# Altium schematic sheet FLASH.SchDoc
size A4
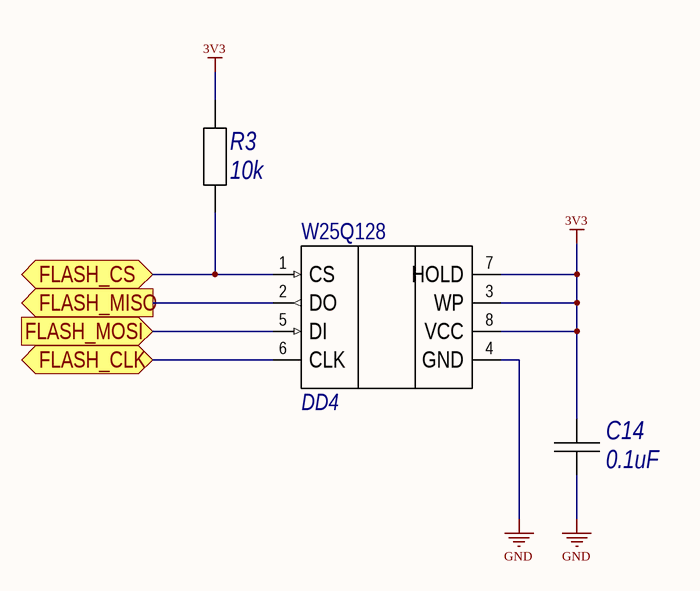
[diagram p0: FLASH.SchDoc]

## Parts
C14  0.1uF  [C0805C]
DD4  W25Q128  [SOIC8 (SO-8)]
R3  10k  [C0805R]

## Ports
FLASH_CLK (bidir), FLASH_CS (bidir), FLASH_MISO (out), FLASH_MOSI (in)

## Nets
3V3: C14.2 DD4.3(WP) DD4.7(HOLD) DD4.8(VCC) R3.2
GND: C14.1 DD4.4(GND)
FLASH_CLK: DD4.6(CLK) ; port FLASH_CLK
FLASH_CS: DD4.1(CS) R3.1 ; port FLASH_CS
FLASH_MISO: DD4.2(DO) ; port FLASH_MISO
FLASH_MOSI: DD4.5(DI) ; port FLASH_MOSI

## Library data of the parts
C14 = CAP_0805: Type: Конденсатор; Published: 18.05.2010; Publisher: Andrew Danich
R3 = RES_0805: Published: 24.03.2010; Publisher: Andrew Danich; Type: Резистор
DD4 = W25Q128: Value: *